# Altium schematic sheet Button_Pad_Breakout-v05.SchDoc
size 270 x 207 mm; Date: 10/2/2017 12:39:21 PM; SheetNumber: 1
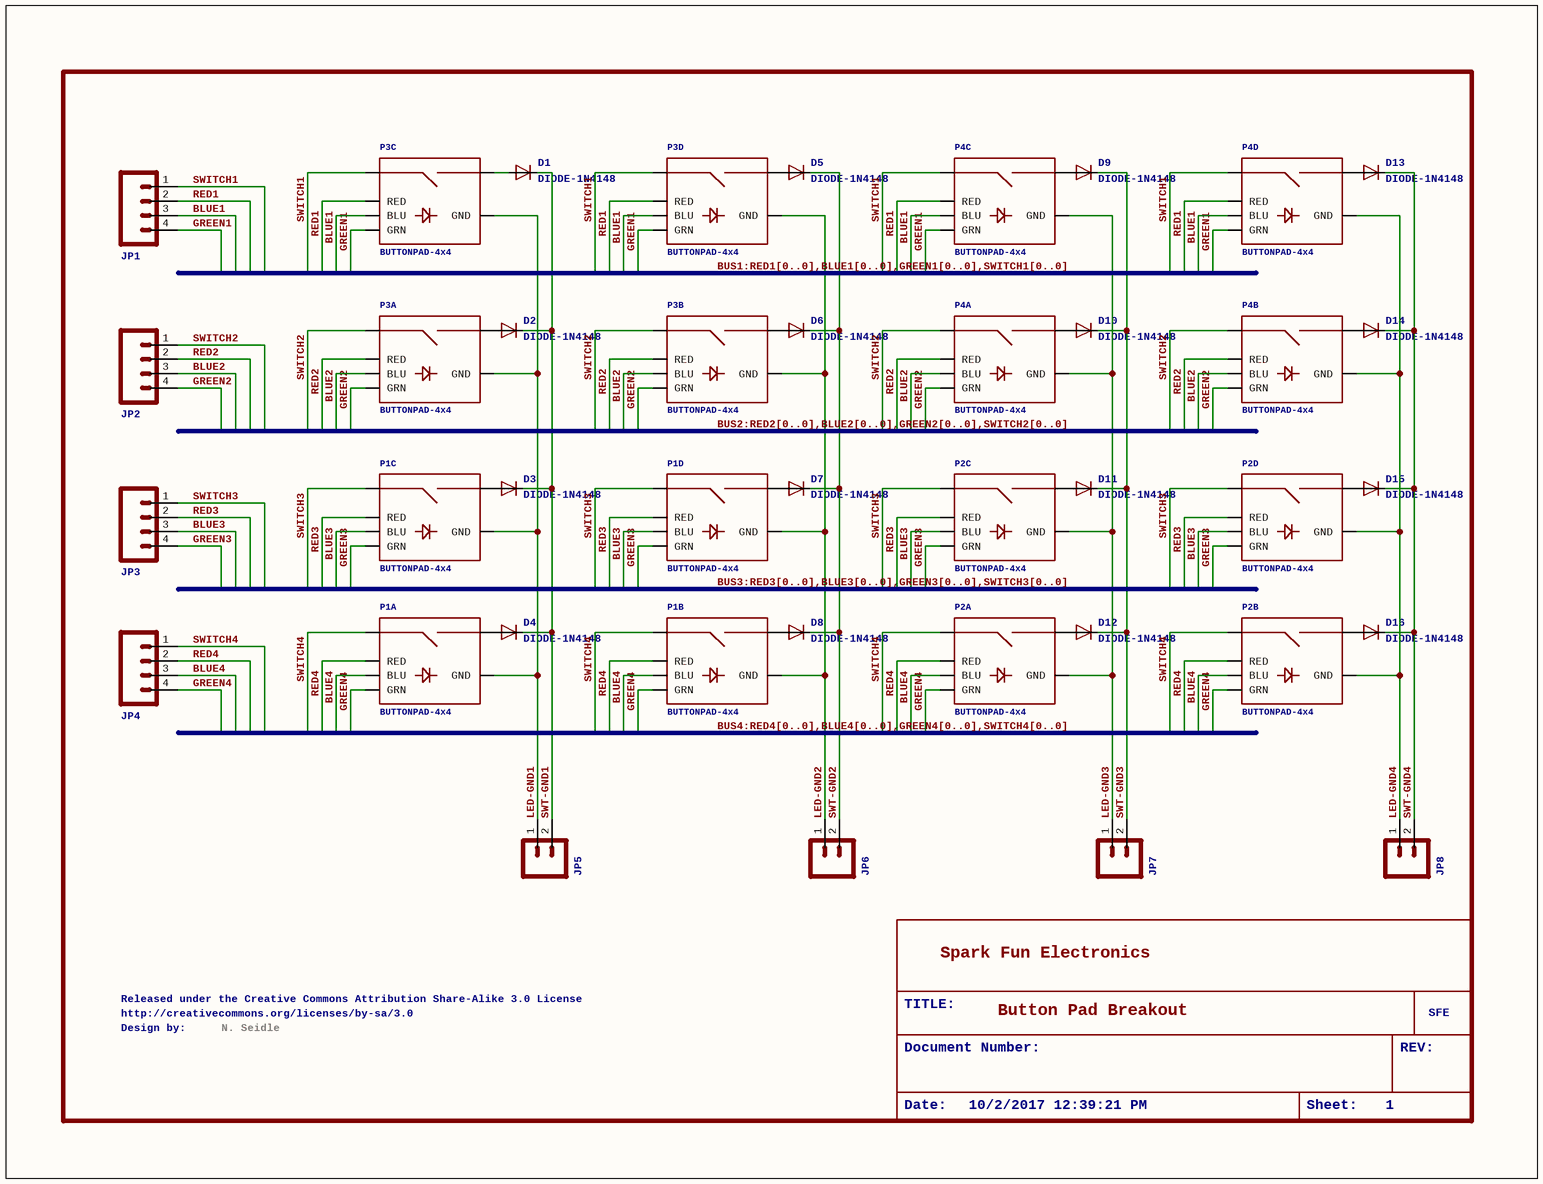
[diagram p0: Button_Pad_Breakout-v05.SchDoc]

## Parts
D1  DIODE-1N4148  [DOIDE-1N4148]
D2  DIODE-1N4148  [DOIDE-1N4148]
D3  DIODE-1N4148  [DOIDE-1N4148]
D4  DIODE-1N4148  [DOIDE-1N4148]
D5  DIODE-1N4148  [DOIDE-1N4148]
D6  DIODE-1N4148  [DOIDE-1N4148]
D7  DIODE-1N4148  [DOIDE-1N4148]
D8  DIODE-1N4148  [DOIDE-1N4148]
D9  DIODE-1N4148  [DOIDE-1N4148]
D10  DIODE-1N4148  [DOIDE-1N4148]
D11  DIODE-1N4148  [DOIDE-1N4148]
D12  DIODE-1N4148  [DOIDE-1N4148]
D13  DIODE-1N4148  [DOIDE-1N4148]
D14  DIODE-1N4148  [DOIDE-1N4148]
D15  DIODE-1N4148  [DOIDE-1N4148]
D16  DIODE-1N4148  [DOIDE-1N4148]
JP1  M04POLAR  [MOLEX-1X4]  (value not drawn)
JP2  M04POLAR  [MOLEX-1X4]  (value not drawn)
JP3  M04POLAR  [MOLEX-1X4]  (value not drawn)
JP4  M04POLAR  [MOLEX-1X4]  (value not drawn)
JP5  M02POLAR  [MOLEX-1X2]  (value not drawn)
JP6  M02POLAR  [MOLEX-1X2]  (value not drawn)
JP7  M02POLAR  [MOLEX-1X2]  (value not drawn)
JP8  M02POLAR  [MOLEX-1X2]  (value not drawn)
P1  BUTTONPAD-4x4  [BUTTONPAD-2X2]  (parts A,B,C,D of 4)
P2  BUTTONPAD-4x4  [BUTTONPAD-2X2]  (parts A,B,C,D of 4)
P3  BUTTONPAD-4x4  [BUTTONPAD-2X2]  (parts A,B,C,D of 4)
P4  BUTTONPAD-4x4  [BUTTONPAD-2X2]  (parts A,B,C,D of 4)
U$1  LOGO-SFE  [SFE-NEW-WEBLOGO]  (value not drawn)
U$2  ReleasedundertheCreativeCommonsAttributionShare-Alike3.0License: Released under the Creative Commons Attribution Share-Alike 3.0 License  Designby: Design by:  [CREATIVE_COMMONS]  (hidden comment: CREATIVE_COMMONS)

## Nets
BLUE1: JP1.3 P3.BLU3(BLU) P3.BLU4(BLU) P4.BLU3(BLU) P4.BLU4(BLU)
BLUE2: JP2.3 P3.BLU1(BLU) P3.BLU2(BLU) P4.BLU1(BLU) P4.BLU2(BLU)
BLUE3: JP3.3 P1.BLU3(BLU) P1.BLU4(BLU) P2.BLU3(BLU) P2.BLU4(BLU)
BLUE4: JP4.3 P1.BLU1(BLU) P1.BLU2(BLU) P2.BLU1(BLU) P2.BLU2(BLU)
GREEN1: JP1.4 P3.GRN3(GRN) P3.GRN4(GRN) P4.GRN3(GRN) P4.GRN4(GRN)
GREEN2: JP2.4 P3.GRN1(GRN) P3.GRN2(GRN) P4.GRN1(GRN) P4.GRN2(GRN)
GREEN3: JP3.4 P1.GRN3(GRN) P1.GRN4(GRN) P2.GRN3(GRN) P2.GRN4(GRN)
GREEN4: JP4.4 P1.GRN1(GRN) P1.GRN2(GRN) P2.GRN1(GRN) P2.GRN2(GRN)
LED-GND1: JP5.1 P1.GND1(GND) P1.GND3(GND) P3.GND1(GND) P3.GND3(GND)
LED-GND2: JP6.1 P1.GND2(GND) P1.GND4(GND) P3.GND2(GND) P3.GND4(GND)
LED-GND3: JP7.1 P2.GND1(GND) P2.GND3(GND) P4.GND1(GND) P4.GND3(GND)
LED-GND4: JP8.1 P2.GND2(GND) P2.GND4(GND) P4.GND2(GND) P4.GND4(GND)
RED1: JP1.2 P3.RED3(RED) P3.RED4(RED) P4.RED3(RED) P4.RED4(RED)
RED2: JP2.2 P3.RED1(RED) P3.RED2(RED) P4.RED1(RED) P4.RED2(RED)
RED3: JP3.2 P1.RED3(RED) P1.RED4(RED) P2.RED3(RED) P2.RED4(RED)
RED4: JP4.2 P1.RED1(RED) P1.RED2(RED) P2.RED1(RED) P2.RED2(RED)
SWITCH1: JP1.1 P3.SIG5(SIG1) P3.SIG7(SIG1) P4.SIG5(SIG1) P4.SIG7(SIG1)
SWITCH2: JP2.1 P3.SIG1 P3.SIG3(SIG1) P4.SIG1 P4.SIG3(SIG1)
SWITCH3: JP3.1 P1.SIG5(SIG1) P1.SIG7(SIG1) P2.SIG5(SIG1) P2.SIG7(SIG1)
SWITCH4: JP4.1 P1.SIG1 P1.SIG3(SIG1) P2.SIG1 P2.SIG3(SIG1)
SWT-GND1: D1.P$2(C) D2.P$2(C) D3.P$2(C) D4.P$2(C) JP5.2
SWT-GND2: D5.P$2(C) D6.P$2(C) D7.P$2(C) D8.P$2(C) JP6.2
SWT-GND3: D9.P$2(C) D10.P$2(C) D11.P$2(C) D12.P$2(C) JP7.2
SWT-GND4: D13.P$2(C) D14.P$2(C) D15.P$2(C) D16.P$2(C) JP8.2
NetD1_P$1: D1.P$1(A) P3.SIG6(SIG2)
NetD2_P$1: D2.P$1(A) P3.SIG2
NetD3_P$1: D3.P$1(A) P1.SIG6(SIG2)
NetD4_P$1: D4.P$1(A) P1.SIG2
NetD5_P$1: D5.P$1(A) P3.SIG8(SIG2)
NetD6_P$1: D6.P$1(A) P3.SIG4(SIG2)
NetD7_P$1: D7.P$1(A) P1.SIG8(SIG2)
NetD8_P$1: D8.P$1(A) P1.SIG4(SIG2)
NetD9_P$1: D9.P$1(A) P4.SIG6(SIG2)
NetD10_P$1: D10.P$1(A) P4.SIG2
NetD11_P$1: D11.P$1(A) P2.SIG6(SIG2)
NetD12_P$1: D12.P$1(A) P2.SIG2
NetD13_P$1: D13.P$1(A) P4.SIG8(SIG2)
NetD14_P$1: D14.P$1(A) P4.SIG4(SIG2)
NetD15_P$1: D15.P$1(A) P2.SIG8(SIG2)
NetD16_P$1: D16.P$1(A) P2.SIG4(SIG2)

## Buses and harness runs
bus BUS1:RED1[0..0],BLUE1[0..0],GREEN1[0..0],SWITCH1[0..0]
bus BUS2:RED2[0..0],BLUE2[0..0],GREEN2[0..0],SWITCH2[0..0]
bus BUS3:RED3[0..0],BLUE3[0..0],GREEN3[0..0],SWITCH3[0..0]
bus BUS4:RED4[0..0],BLUE4[0..0],GREEN4[0..0],SWITCH4[0..0]

## Notes on the sheet
- Spark Fun Electronics
- N. Seidle
- TITLE:
- Document Number:
- Button Pad Breakout
- (near U$1) REV:
- Date:
- 10/2/2017 12:39:21 PM
- Sheet:
- 1

## Library data of the parts
JP1-JP4 = M04POLAR: Header 4Standard 4-pin 0.1" header. Use with straight break away headers (SKU : PRT-00116), right angle break away headers (PRT-00553), swiss pins (PRT-00743), machine pins (PRT-00117), and female headers (PRT-00115). Molex polarized connector foot print use with SKU : PRT-08231 with associated crimp pins and housings.
JP5-JP8 = M02POLAR: Header 2Standard 2-pin 0.1" header. Use with straight break away headers (SKU : PRT-00116), right angle break away headers (PRT-00553), swiss pins (PRT-00743), machine pins (PRT-00117), and female headers (PRT-00115). Molex polarized connector foot print use with SKU : PRT-08233 with associated crimp pins and housings.
P1-P4 = BUTTONPAD-2X2: 5mm Button PadProven layout and schematic for 2x2 button pad. Panelize this device/fp to a 4x4 pad if needed. Spark Fun Electronics SKU : COM-07835. Compatible common cathode tri-color LED SKU : COM-00105
U$1 = LOGO-SFE: Spark Fun Electronics PCB LogoThis is the standard Spark Fun Electronics PCB logo.; SFE: SFE
U$2 = CREATIVE_COMMONS: http://creativecommons.org/licenses/by-sa/3.0: http://creativecommons.org/licenses/by-sa/3.0